# Altium project Sirius_Black.PrjPcb (part 2 of 2)

## Sheet Sensor Suite 1.SchDoc
size A4; SheetNumber: 4; SheetTotal: 6
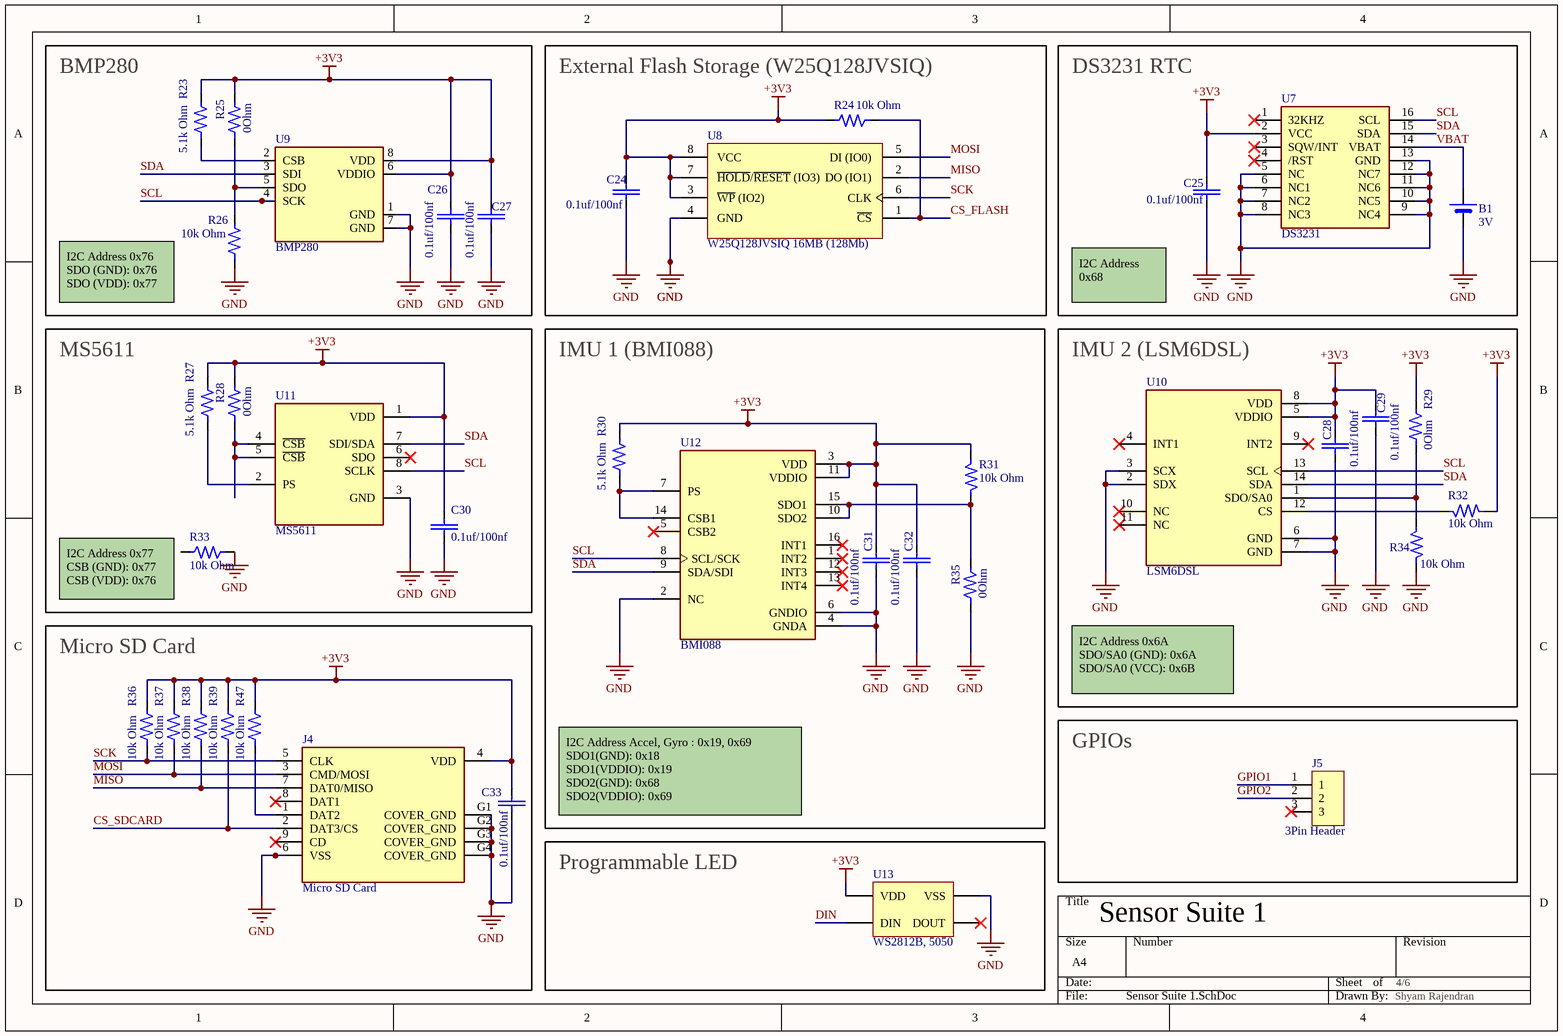
[diagram p3: Sensor Suite 1.SchDoc]

### Parts
B1  3V  [Battery Holder]
C24  0.1uf/100nf  [0.1uF Capacitor]
C25  0.1uf/100nf  [0.1uF Capacitor]
C26  0.1uf/100nf  [0.1uF Capacitor]
C27  0.1uf/100nf  [0.1uF Capacitor]
C28  0.1uf/100nf  [0.1uF Capacitor]
C29  0.1uf/100nf  [0.1uF Capacitor]
C30  0.1uf/100nf  [0.1uF Capacitor]
C31  0.1uf/100nf  [0.1uF Capacitor]
C32  0.1uf/100nf  [0.1uF Capacitor]
C33  0.1uf/100nf  [0.1uF Capacitor]
J4  Micro SD Card  [Micro SD Card]
J5  3Pin Header  [3 Pin Header]
R23  5.1k Ohm  [RESC2012X60N]
R24  10k Ohm  [RESC2013X60X35ML10T20]
R25  0Ohm  [1k 0805 Resistor]
R26  10k Ohm  [RESC2013X60X35ML10T20]
R27  5.1k Ohm  [RESC2012X60N]
R28  0Ohm  [1k 0805 Resistor]
R29  0Ohm  [1k 0805 Resistor]
R30  5.1k Ohm  [RESC2012X60N]
R31  10k Ohm  [RESC2013X60X35ML10T20]
R32  10k Ohm  [RESC2013X60X35ML10T20]
R33  10k Ohm  [RESC2013X60X35ML10T20]
R34  10k Ohm  [RESC2013X60X35ML10T20]
R35  0Ohm  [1k 0805 Resistor]
R36  10k Ohm  [RESC2013X60X35ML10T20]
R37  10k Ohm  [RESC2013X60X35ML10T20]
R38  10k Ohm  [RESC2013X60X35ML10T20]
R39  10k Ohm  [RESC2013X60X35ML10T20]
R47  10k Ohm  [RESC2013X60X35ML10T20]
U7  DS3231 RTC  [DS3231]  (value not drawn)
U8  W25Q128JVSIQ 16MB (128Mb)  [W25Q128JVSIQ]
U9  BMP280  [BMP280]
U10  LSM6DSL  [LSM6DSO32TR]
U11  MS5611  [MS561101BA03-50]
U12  BMI088  [BMI088]
U13  WS2812B, 5050  [WS2812B]

### Blocks framed on the sheet
BMP280: C26 C27 R23 R25 R26 U9
External Flash Storage (W25Q128JVSIQ): C24 R24 U8
DS3231 RTC: B1 C25 U7
MS5611: C30 R27 R28 R33 U11
IMU 1 (BMI088): C31 C32 R30 R31 R35 U12
IMU 2 (LSM6DSL): C28 C29 R29 R32 R34 U10
Micro SD Card: C33 J4 R36-R39 R47
GPIOs: J5
Programmable LED: U13

### Nets
+3V3: C24.1 C25.1 C26.2 C27.2 C28.2 C29.2 C30.2 C31.2 C32.2 C33.2 J4.4(VDD) R23.2 R24.2 R25.2 R27.2 R28.2 R29.2 R30.2 R31.2 R32.1 R36.2 R37.2 R38.2 R39.2 R47.2 U7.2(VCC) U8.3(~{WP}_(IO2)) U8.7(~{HOLD}/~{RESET}_(IO3)) U8.8(VCC) U9.6(VDDIO) U9.8(VDD) U10.5(VDDIO) U10.8(VDD) U11.1(VDD) U12.3(VDD) U12.11(VDDIO) U13.VDD
GND: B1.N C24.2 C25.2 C26.1 C27.1 C28.1 C29.1 C30.1 C31.1 C32.1 C33.1 J4.6(VSS) J4.G1(COVER_GND) J4.G2(COVER_GND) J4.G3(COVER_GND) J4.G4(COVER_GND) R26.1 R33.1 R34.1 R35.1 U7.5(NC) U7.6(NC1) U7.7(NC2) U7.8(NC3) U7.9(NC4) U7.10(NC5) U7.11(NC6) U7.12(NC7) U7.13(GND) U8.4(GND) U9.1(GND) U9.7(GND) U10.2(SDX) U10.3(SCX) U10.6(GND) U10.7(GND) U11.3(GND) U12.2(NC) U12.4(GNDA) U12.6(GNDIO) U13.VSS
CS_FLASH: R24.1 U8.1(~{CS})
CS_SDCARD: J4.2(DAT3/CS) R39.1
DIN: U13.DIN
GPIO1: J5.1
GPIO2: J5.2
MISO: J4.7(DAT0/MISO) R38.1 U8.2(DO_(IO1))
MOSI: J4.3(CMD/MOSI) R37.1 U8.5(DI_(IO0))
SCK: J4.5(CLK) R36.1 U8.6(CLK)
SCL: U7.16(SCL) U9.4(SCK) U10.13(SCL) U11.8(SCLK) U12.8(SCL/SCK)
SDA: U7.15(SDA) U9.3(SDI) U10.14(SDA) U11.7(SDI/SDA) U12.9(SDA/SDI)
VBAT: B1.P U7.14(VBAT)
NetJ4_1: J4.1(DAT2) R47.1
NetR23_1: R23.1 U9.2(CSB)
NetR25_1: R25.1 R26.2 U9.5(SDO)
NetR27_1: R27.1 U11.2(PS)
NetR28_1: R28.1 U11.4(~{CSB}) U11.5(~{CSB})
NetR29_1: R29.1 R34.2 U10.1(SDO/SA0)
NetR30_1: R30.1 U12.7(PS) U12.14(CSB1)
NetR31_1: R31.1 R35.2 U12.10(SDO2) U12.15(SDO1)
NetR32_2: R32.2 U10.12(CS)

Not connected (* = marked no-connect by the designer): J4 8(DAT1)* 9(CD)*; J5 3*; R33 2; U7 1(32KHZ)* 3(SQW/INT)* 4(/RST)*; U10 4(INT1)* 9(INT2)* 10(NC)* 11(NC)*; U11 6(SDO)*; U12 1(INT2)* 5(CSB2)* 12(INT3)* 13(INT4)* 16(INT1)*; U13 DOUT*

### Notes on the sheet
- I2C Address 0x76
  SDO (GND): 0x76
  SDO (VDD): 0x77
- I2C Address 0x68
- (near R33) I2C Address 0x77
  CSB (GND): 0x77
  CSB (VDD): 0x76
- I2C Address 0x6A
  SDO/SA0 (GND): 0x6A
  SDO/SA0 (VCC): 0x6B
- (near C33) I2C Address Accel, Gyro : 0x19, 0x69
  SDO1(GND): 0x18
  SDO1(VDDIO): 0x19
  SDO2(GND): 0x68
  SDO2(VDDIO): 0x69
- Sensor Suite 1 <BMP280>
- 4/6 <BMP280>
- Shyam Rajendran <BMP280>

### Library data of the parts
B1 = Button Cell: CR2032 Button Cell
C24-C33 = CC0805KRX7R9BB104: 0.1 uF, Multilayer Ceramic Capacitor, 50 V, ï¿½ 10%, X7R, 0805 [2012 Metric]; Manufacturer: Yageo; Value: 100nF; Voltage Rating: 50V; Insulation Resistance: 100GR; Supplier: Future Electronics; Supplier Part Number: 2986263; Manufacturer Part Number: CC0805KRX7R9BB104; RoHS: Yes; Category: Ceramic Capacitors; Stock: 2884000; Pricing: 4000=0.009, 12000=0.0088, 40000=0.0085, 80000=0.0083, 160000=0.008 (USD); Mounting Technology: Surface Mount; Case/Package: 0805; Pins: 2; Case Code (Metric): 2012; Case Code (Imperial): 0805; Material: Ceramic; Min Operating Temperature: -55°C; Max Operating Temperature: 125°C; Packaging: Tape and Reel; Tolerance: 10%; Dielectric: X7R; Series: CC; Package Quantity: 4000; Voltage: 50V; Termination: SMD/SMT; Length: 2mm; Height: 0.85mm; Depth: 1.25mm; Radiation Hardening: No; RoHS Compliant: Yes; Lead Free: 5697LeadFree; Reach SVHC Compliant: No; Halogen Free: 5694HalogenFree
J4 = Micro SD Card: Micro SD Card Connector, 9 Positions, Connector and Ejector, Push In, Auto Eject Out, Surface Mount, 1.8 mm Height Above Board, Gold Flash; MF: CUI Devices; MP: MSD-1-A; SnapEDA_Link: https://www.snapeda.com/parts/MSD-1-A/CUI+Devices/view-part/?ref=snap; Package: None; Value: *; CUI_purchase_URL: https://www.cuidevices.com/product/interconnect/connectors/memory-card-connectors/sd-card-connectors/msd-1-a?utm_source=snapeda.com&utm_medium=referral&utm_campaign=snapedaBOM; Check_prices: https://www.snapeda.com/parts/MSD-1-A/CUI+Devices/view-part/?ref=eda
J5 = Header 3pin
R23 R27 R30 = RC0805FR-075K1L: 5.1k Ohm, 0805, 0.125W, 150V, 1% +/-Tol, 100ppm/Cel, Surface Mount; Manufacturer: Yageo; Additional Feature: LASER TRIMMABLE; Power: 125mW; Rated Temperature: 70°C; Value: 5.1kR; Temperature Coefficient (ppm/Cel): 100; Package Height: 0.5mm; Package Length: 2mm; Package Width: 1.25mm; Supplier: Future Electronics; Supplier Part Number: 5647425; Manufacturer Part Number: RC0805FR-075K1L; RoHS: Yes; Category: Chip SMD Resistors; Stock: 15000; Pricing: 5000=0.0021, 20000=0.002, 100000=0.0019, 200000=0.0018, 625000=0.0017 (USD); Mounting Technology: Surface Mount; Pins: 2; Package Shape: Rectangular; Case/Package: 0805; Terminal Finish: Nickel; Min Operating Temperature: -55°C; Max Operating Temperature: 155°C; Tolerance: 1%; JESD-609 Code: e3; Termination: Wraparound; Resistor Type: FIXED RESISTOR; Construction: Chip; Packaging: Tape and Reel; Technology: METAL GLAZE/THICK FILM; Working Voltage: 150V; Reach SVHC Compliant: Yes; RoHS Compliant: Yes; ComponentLink1URL: https://datasheet.ciiva.com:443/pdfs/VipMasterIC/IC/YAGO/YAGO-S-A0008145938/YAGO-S-A0008145938-1.pdf?src-supplier=IHS+Markit; ComponentLink1Description: https://datasheet.ciiva.com:443/pdfs/VipMasterIC/IC/YAGO/YAGO-S-A0008145938/YAGO-S-A0008145938-1.pdf?src-supplier=IHS+Markit; ComponentLink2URL: https://datasheet.ciiva.com/11808/0900766b8106beab-11808171.pdf?src-supplier=Rs; ComponentLink2Description: https://datasheet.ciiva.com/11808/0900766b8106beab-11808171.pdf?src-supplier=Rs; ComponentLink3URL: https://datasheet.ciiva.com/2456/pyu-r-int-thick-7-2456979.pdf?src-supplier=Digikey; ComponentLink3Description: https://datasheet.ciiva.com/2456/pyu-r-int-thick-7-2456979.pdf?src-supplier=Digikey; ComponentLink4URL: https://datasheet.ciiva.com/2456/pyu-r-int-thick-7-2456980.pdf?src-supplier=Digikey; ComponentLink4Description: https://datasheet.ciiva.com/2456/pyu-r-int-thick-7-2456980.pdf?src-supplier=Digikey; ComponentLink5URL: https://datasheet.ciiva.com/15189/getdatasheetpartid-326574-15189996.pdf?src-supplier=Verical; ComponentLink5Description: https://datasheet.ciiva.com/15189/getdatasheetpartid-326574-15189996.pdf?src-supplier=Verical; ComponentLink6URL: https://datasheet.ciiva.com/2456/pyu-r-int-thick-7-2456978.pdf?src-supplier=Digikey; ComponentLink6Description: https://datasheet.ciiva.com/2456/pyu-r-int-thick-7-2456978.pdf?src-supplier=Digikey
R24 R26 R31-R34 R36-R39 R47 = RC0805FR-0710KL: 10 kOhm, SMD Chip Resistor, ï¿½ 1%, 125 mW, 0805 [2012 Metric], Thick Film, General Purpose; Manufacturer: Yageo; Value: 10kR; Power Rating: 125mW; Voltage Rating: 150V; Temperature Coefficient: 100ppm/°C; Supplier: Future Electronics; Supplier Part Number: 3310877; Manufacturer Part Number: RC0805FR-0710KL; RoHS: Yes; Category: Chip SMD Resistors; Stock: 15945000; Pricing: 5000=0.0021, 20000=0.002, 100000=0.0019, 200000=0.0018, 625000=0.0017 (USD); Case/Package: 0805; Case Code (Imperial): 0805; Case Code (Metric): 2012; Min Operating Temperature: -55°C; Max Operating Temperature: 155°C; Packaging: Tape and Reel; Tolerance: 1%; Termination: SMD/SMT; Number of Terminations: 2; Max Power Dissipation: 125mW; Features: Moisture Resistant; Series: RC; Resistor Type: Thick Film; Construction: Rectangular; Resistance Tolerance: 1%; Package Quantity: 1; Technology: THICK FILM; Voltage Rating (AC): 150V; Length: 0.079inch; Width: 0.049inch; Height: 0.024inch; Depth: 1.25mm; Lead Free: Lead Free; RoHS Compliant: Yes; Military Standard: Not; Reach SVHC Compliant: Unknown; ComponentLink1URL: https://datasheet.ciiva.com/11808/0900766b8106beab-11808151.pdf?src-supplier=Rs; ComponentLink1Description: https://datasheet.ciiva.com/11808/0900766b8106beab-11808151.pdf?src-supplier=Rs; ComponentLink2URL: https://datasheet.ciiva.com/46447/444164-46447563.pdf?src-supplier=Element14; ComponentLink2Description: https://datasheet.ciiva.com/46447/444164-46447563.pdf?src-supplier=Element14; ComponentLink3URL: https://datasheet.ciiva.com/2456/pyu-r-int-thick-7-2456973.pdf?src-supplier=Digikey; ComponentLink3Description: https://datasheet.ciiva.com/2456/pyu-r-int-thick-7-2456973.pdf?src-supplier=Digikey; ComponentLink4URL: https://datasheet.ciiva.com/2456/pyu-r-int-thick-7-2456974.pdf?src-supplier=Digikey; ComponentLink4Description: https://datasheet.ciiva.com/2456/pyu-r-int-thick-7-2456974.pdf?src-supplier=Digikey; ComponentLink5URL: https://datasheet.ciiva.com/2456/pyu-r-int-thick-7-2456972.pdf?src-supplier=Digikey; ComponentLink5Description: https://datasheet.ciiva.com/2456/pyu-r-int-thick-7-2456972.pdf?src-supplier=Digikey; ComponentLink6URL: https://datasheet.ciiva.com/12669/rc0805-12669688.pdf?src-supplier=Mouser; ComponentLink6Description: https://datasheet.ciiva.com/12669/rc0805-12669688.pdf?src-supplier=Mouser; ComponentLink7URL: https://datasheet.ciiva.com/16747/rc0805-16747087.pdf?src-supplier=Future+Electronics; ComponentLink7Description: https://datasheet.ciiva.com/16747/rc0805-16747087.pdf?src-supplier=Future+Electronics
R25 R28 R29 R35 = CRCW08050000Z0EA: 0 Ohm Resistor, Jumper, 0805 [2012 Metric], Thick Film, 125 mW, Surface Mount; Manufacturer: Vishay; Value: 0mR; Power Rating: 125mW; Temperature Coefficient: 100ppm/°C; Voltage Rating: 150V; Tolerance: 1%; Supplier: Arrow Electronics; Supplier Part Number: CRCW08050000Z0EA; Manufacturer Part Number: CRCW08050000Z0EA; RoHS: Yes; Category: Chip SMD Resistors; Stock: 1390000; Pricing: 5000=0.0051, 10000=0.005, 15000=0.0049, 25000=0.0045 (USD); Case/Package: 0805; Case Code (Imperial): 0805; Case Code (Metric): 2012; Contact Plating: Tin; Weight: 0.000194oz; Min Operating Temperature: -55°C; Max Operating Temperature: 155°C; Packaging: Tape and Reel; Series: CRCW; Number of Terminations: 2; Resistor Type: Thick Film; Termination: SMD/SMT; Max Power Dissipation: 125mW; Package Quantity: 1; Features: Automotive AEC-Q200; Construction: Rectangular; Technology: THICK FILM; Voltage Rating (DC): 150V; Resistance Tolerance: 1%; Length: 2mm; Width: 0.049inch; Height: 0.45mm; Depth: 1.25mm; Radiation Hardening: No; RoHS Compliant: Yes; Military Standard: Not; Reach SVHC Compliant: Unknown; Lead Free: 5697LeadFree; ComponentLink1URL: https://datasheet.ciiva.com/11811/0900766b80d98b26-11811304.pdf?src-supplier=Rs; ComponentLink1Description: https://datasheet.ciiva.com/11811/0900766b80d98b26-11811304.pdf?src-supplier=Rs; ComponentLink2URL: https://datasheet.ciiva.com/7841/1720486-7841839.pdf?src-supplier=Element14; ComponentLink2Description: https://datasheet.ciiva.com/7841/1720486-7841839.pdf?src-supplier=Element14; ComponentLink3URL: https://datasheet.ciiva.com/26314/fld-crcw-e3-data-en-26314630.pdf?src-supplier=Distrelec; ComponentLink3Description: https://datasheet.ciiva.com/26314/fld-crcw-e3-data-en-26314630.pdf?src-supplier=Distrelec; ComponentLink4URL: https://datasheet.ciiva.com/7841/1697337-7841629.pdf?src-supplier=Element14; ComponentLink4Description: https://datasheet.ciiva.com/7841/1697337-7841629.pdf?src-supplier=Element14; ComponentLink5URL: https://datasheet.ciiva.com/2463/dcrcwe3-2463038.pdf?src-supplier=Digikey; ComponentLink5Description: https://datasheet.ciiva.com/2463/dcrcwe3-2463038.pdf?src-supplier=Digikey; ComponentLink6URL: https://datasheet.ciiva.com/2463/dcrcwe3-2463039.pdf?src-supplier=Digikey; ComponentLink6Description: https://datasheet.ciiva.com/2463/dcrcwe3-2463039.pdf?src-supplier=Digikey; ComponentLink7URL: https://datasheet.ciiva.com/2463/dcrcwe3-2463037.pdf?src-supplier=Digikey; ComponentLink7Description: https://datasheet.ciiva.com/2463/dcrcwe3-2463037.pdf?src-supplier=Digikey; ComponentLink8URL: https://datasheet.ciiva.com/16719/70201119-16719706.pdf?src-supplier=Allied+Electronics; ComponentLink8Description: https://datasheet.ciiva.com/16719/70201119-16719706.pdf?src-supplier=Allied+Electronics; ComponentLink9URL: https://datasheet.ciiva.com/5543/dcrcwe3-109170-5543096.pdf?src-supplier=Mouser; ComponentLink9Description: https://datasheet.ciiva.com/5543/dcrcwe3-109170-5543096.pdf?src-supplier=Mouser; ComponentLink10URL: https://datasheet.ciiva.com/16389/dcrcwe3-16389338.pdf?src-supplier=Future+Electronics; ComponentLink10Description: https://datasheet.ciiva.com/16389/dcrcwe3-16389338.pdf?src-supplier=Future+Electronics
U7 = DS3231: Real Time Clock (RTC) IC Clock/Calendar - IÂ²C, 2-Wire Serial 8-SOIC (0.154, 3.90mm Width); MF: Maxim Integrated; Check_prices: https://www.snapeda.com/parts/DS3231/Maxim+Integrated/view-part/?ref=eda; Value: *; Availability: In Stock; MP: DS3231; Price: None; Package: SOIC-16 Maxim Integrated; SnapEDA_Link: https://www.snapeda.com/parts/DS3231/Maxim+Integrated/view-part/?ref=snap; Purchase-URL: https://pricing.snapeda.com/search/part/DS3231/?ref=eda
U8 = W25Q128JVSIQ TR: 16MB (128Mb) Flash, PDSO8; Manufacturer: Winbond; Package Body Material: Plastic; Clock Frequency: 133MHz; Density: 134217728b; Memory Width: 8; Channels: 1; Memory Size: 16777216; Number of Words Code: 16M; Operating Mode: SYNCHRONOUS; Organization: 16MX8; Parallel/Serial: SERIAL; Programming Voltage: 3V; Max Supply Voltage: 3.6V; Min Supply Voltage: 2.7V; Supplier: Digikey; Supplier Part Number: W25Q128JVSIQCT-ND; Manufacturer Part Number: W25Q128JVSIQ TR; RoHS: Yes; Category: Flash; Stock: 210919; Pricing: 1=1.57, 10=1.472, 25=1.4304, 50=1.3988, 100=1.3668, 250=1.32448, 500=1.2926, 1000=1.26092, 2000=1.22957, 4000=1.19866, 6000=1.18081 (USD); Case/Package: SOP; Pins: 8; Package Shape: Square; Min Operating Temperature: -40°C; Max Operating Temperature: 85°C; Memory Format: FLASH; Type: NOR TYPE; JESD-30 Code: S-PDSO-G8; Package Style: SMALL OUTLINEMeter; Nominal Supply Voltage: 3V; Surface Mount: Yes; Technology: CMOS; Terminal Form: Gull Wing; Terminal Position: DUAL; Length: 5.23mm; Width: 5.23mm; Height - Seated (Max): 2.16mm; Terminal Pitch: 1.27mm; Temperature Grade: INDUSTRIAL; Reach SVHC Compliant: Yes; RoHS Compliant: Yes; ComponentLink1URL: https://datasheet.ciiva.com:443/pdfs/VipMasterIC/IC/WBND/WBND-S-A0002933800/WBND-S-A0002933800-1.pdf?src-supplier=IHS+Markit; ComponentLink1Description: https://datasheet.ciiva.com:443/pdfs/VipMasterIC/IC/WBND/WBND-S-A0002933800/WBND-S-A0002933800-1.pdf?src-supplier=IHS+Markit; ComponentLink2URL: http://www.winbond.com/resource-files/w25q128jv%20revf%2003272018%20plus.pdf?src-supplier=Digikey; ComponentLink2Description: http://www.winbond.com/resource-files/w25q128jv%20revf%2003272018%20plus.pdf?src-supplier=Digikey; ComponentLink3URL: http://www.winbond.com/resource-files/w25q128jv%20spi%20revc%2011162016.pdf?src-supplier=Digikey; ComponentLink3Description: http://www.winbond.com/resource-files/w25q128jv%20spi%20revc%2011162016.pdf?src-supplier=Digikey
U9 = BMP280: BMP280 Absolute Barometric Pressure Sensor for Battery Powered Devices 2 x 2.5mm; Package: None; Availability: Unavailable; MP: BMP280; Value: *; Price: None
U10 = LSM6DSL: Accelerometer, Gyroscope, Temperature, 6 Axis Sensor IÂ²C, SPI Output; MF: STMicroelectronics; SnapEDA_Link: https://www.snapeda.com/parts/LSM6DSO32TR/STMicroelectronics/view-part/?ref=snap; Package: VFLGA-14 STMicroelectronics; Value: *; MP: LSM6DSO32TR; Check_prices: https://www.snapeda.com/parts/LSM6DSO32TR/STMicroelectronics/view-part/?ref=eda
U11 = MS561101BA03-50: Sensor;MS5611-BT M-CAPS 3X5X1MM T&R;Pressure;MS561101BA03-50 | TE Connectivity MS561101BA03-50; SnapEDA_Link: https://www.snapeda.com/parts/MS561101BA03-50/TE+Connectivity+ALCOSWITCH+Switches/view-part/?ref=snap; Package: SMD-8 Measurement Specialties; Value: *; MF: TE Connectivity; MP: MS561101BA03-50; Check_prices: https://www.snapeda.com/parts/MS561101BA03-50/TE+Connectivity+ALCOSWITCH+Switches/view-part/?ref=eda
U12 = BMI088: High-performance 6-axis inertial sensor (accelerometer + gyroscope) <a href="https://pricing.snapeda.com/parts/BMI088/Bosch%20Sensortec/view-part?ref=eda">Check prices</a>; Package: None; MP: BMI088; Value: *; Availability: Unavailable; Price: None
U13 = WS2812B: Intelligent Control LED Integrated Light Source, 3.5 to 5.3 V, -25 to 80 degC, 4-Pin SMD, RoHS, Tape and Reel; Manufacturer: Adafruit-Industries-LLC; Number of LEDs: 10; Configuration: Discrete; Utilized LED: WS2812(5050); Datasheet URL: http://datasheet.octopart.com/ADA1655-Adafruit-Industries-datasheet-32028139.pdf; Series: Neopixel; Interface: -; Package Description: 4-Pin Surface Mount Device, Body 5 x 5 mm; Color: Red,Green,Blue(RGB); Category: Optoelectronics; Controller Type: -; Package Reference: 1655; Manufacturer URL: https://www.adafruit.com/; Mounting Type: SurfaceMount; Datasheet Version: May-13; Size / Dimension: 5.00mmLx5.00mmW; Family: Addressable,Specialty

## Sheet Sensor Suite 2.SchDoc
size A4; SheetNumber: 5; SheetTotal: 6
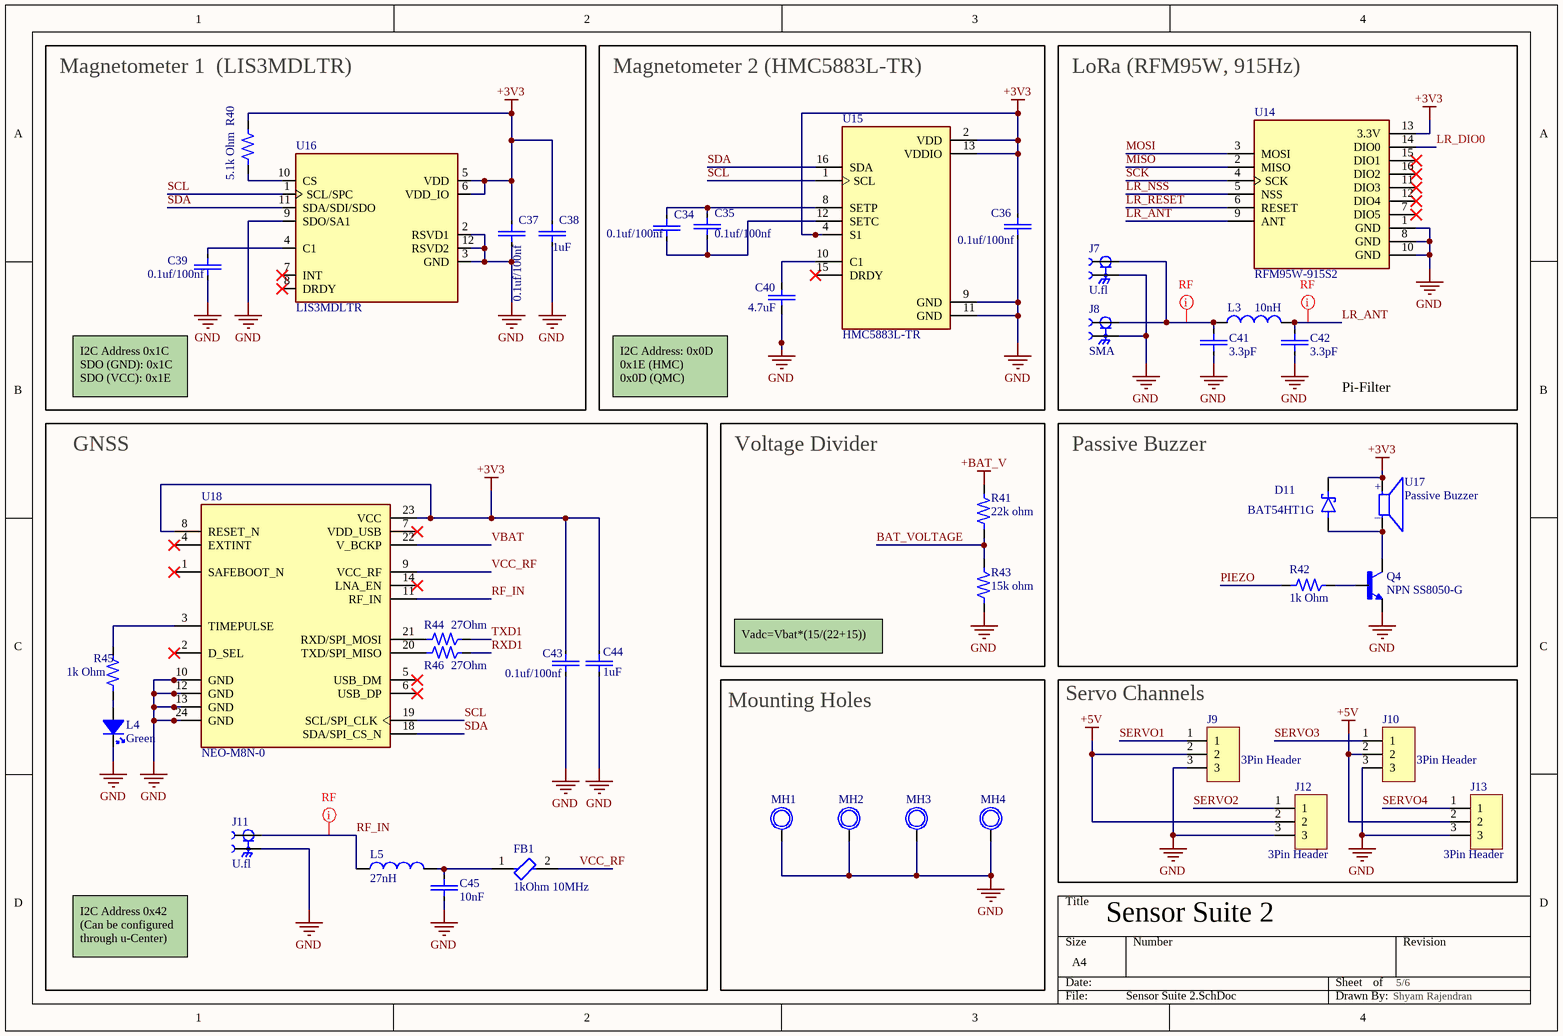
[diagram p4: Sensor Suite 2.SchDoc]

### Parts
C34  0.1uf/100nf  [0.1uF Capacitor]
C35  0.1uf/100nf  [0.1uF Capacitor]
C36  0.1uf/100nf  [0.1uF Capacitor]
C37  0.1uf/100nf  [0.1uF Capacitor]
C38  1uF  [10uf Capacitor]
C39  0.1uf/100nf  [0.1uF Capacitor]
C40  4.7uF  [1k 0805 Resistor]
C41  3.3pF  [3.3pF]
C42  3.3pF  [3.3pF]
C43  0.1uf/100nf  [0.1uF Capacitor]
C44  1uF  [10uf Capacitor]
C45  10nF  [3.3pF]
D11  BAT54HT1G  [SOD2513X110N]
FB1  1kOhm 10MHz  [1kOhm Ferrite bead 0402]
J7  U.fl  [U.fl]
J8  SMA  [SMA_CONNECTOR]
J9  3Pin Header  [3 Pin Header]
J10  3Pin Header  [3 Pin Header]
J11  U.fl  [U.fl]
J12  3Pin Header  [3 Pin Header]
J13  3Pin Header  [3 Pin Header]
L3  10nH  [0402 10nH]
L4  Green  [LED Green]
L5  27nH  [0402 10nH]
MH1  PMH 3.0  [PMH]  (value not drawn)
MH2  PMH 3.0  [PMH]  (value not drawn)
MH3  PMH 3.0  [PMH]  (value not drawn)
MH4  PMH 3.0  [PMH]  (value not drawn)
Q4  NPN SS8050-G  [Transistor_SS8050-G]
R40  5.1k Ohm  [RESC2012X60N]
R41  22k ohm  [1k 0805 Resistor]
R42  1k Ohm  [1k 0805 Resistor]
R43  15k ohm  [1k 0805 Resistor]
R44  27Ohm  [1k 0805 Resistor]
R45  1k Ohm  [1k 0805 Resistor]
R46  27Ohm  [1k 0805 Resistor]
U14  RFM95W-915S2  [RFM95W-915S2]
U15  HMC5883L-TR  [HMC5883L-TR]
U16  LIS3MDLTR  [LIS3MDLTR]
U17  Passive Buzzer  [BuzzerCMT-7525-80-SMT-TR]
U18  NEO-M8N-0  [NEO-M8N-0]

### Blocks framed on the sheet
Magnetometer 1  (LIS3MDLTR): C37-C39 R40 U16
Magnetometer 2 (HMC5883L-TR): C34-C36 C40 U15
LoRa (RFM95W, 915Hz): C41 C42 J7 J8 L3 U14
GNSS: C43-C45 FB1 J11 L4 L5 R44-R46 U18
Voltage Divider: R41 R43
Passive Buzzer: D11 Q4 R42 U17
Mounting Holes: MH1-MH4
Servo Channels: J9 J10 J12 J13

### Nets
+3V3: C36.2 C37.2 C38.2 C43.2 C44.2 D11.C(K) R40.2 U14.13(3.3V) U15.2(VDD) U15.4(S1) U15.13(VDDIO) U16.5(VDD) U16.6(VDD_IO) U17.P U18.8(RESET_N) U18.23(VCC)
+5V: J9.2 J10.2 J12.2 J13.2
+BAT_V: R41.2
GND: C36.1 C37.1 C38.1 C39.1 C40.1 C41.1 C42.1 C43.1 C44.1 C45.1 J7.GND J8.GND J9.3 J10.3 J11.GND J12.3 J13.3 L4.C MH1.GND MH2.GND MH3.GND MH4.GND Q4.2(E) R43.1 U14.1(GND) U14.8(GND) U14.10(GND) U15.9(GND) U15.11(GND) U16.2(RSVD1) U16.3(GND) U16.9(SDO/SA1) U16.12(RSVD2) U18.10(GND) U18.12(GND) U18.13(GND) U18.24(GND)
BAT_VOLTAGE: R41.1 R43.2
LR_ANT: C42.2 L3.2 U14.9(ANT)
LR_DIO0: U14.14(DIO0)
LR_NSS: U14.5(NSS)
LR_RESET: U14.6(RESET)
MISO: U14.2(MISO)
MOSI: U14.3(MOSI)
PIEZO: R42.1
RF_IN: J11.1 L5.1 U18.11(RF_IN)
RXD1: R46.2
SCK: U14.4(SCK)
SCL: U15.1(SCL) U16.1(SCL/SPC) U18.19(SCL/SPI_CLK)
SDA: U15.16(SDA) U16.11(SDA/SDI/SDO) U18.18(SDA/SPI_CS_N)
SERVO1: J9.1
SERVO2: J12.1
SERVO3: J10.1
SERVO4: J13.1
TXD1: R44.2
VBAT: U18.22(V_BCKP)
VCC_RF: FB1.2 U18.9(VCC_RF)
NetC34_1: C34.1 C35.1 U15.12(SETC)
NetC34_2: C34.2 C35.2 U15.8(SETP)
NetC39_2: C39.2 U16.4(C1)
NetC40_2: C40.2 U15.10(C1)
NetC41_2: C41.2 J7.1 J8.1 L3.1
NetC45_2: C45.2 FB1.1 L5.2
NetD11_A: D11.A Q4.3(C) U17.N
NetL4_A: L4.A R45.1
NetQ4_1: Q4.1(B) R42.2
NetR40_1: R40.1 U16.10(CS)
NetR44_1: R44.1 U18.21(RXD/SPI_MOSI)
NetR45_2: R45.2 U18.3(TIMEPULSE)
NetR46_1: R46.1 U18.20(TXD/SPI_MISO)

Not connected (* = marked no-connect by the designer): U14 7(DIO5)* 11(DIO3)* 12(DIO4)* 15(DIO1)* 16(DIO2)*; U15 15(DRDY)*; U16 7(INT)* 8(DRDY)*; U18 1(SAFEBOOT_N)* 2(D_SEL)* 4(EXTINT)* 5(USB_DM)* 6(USB_DP)* 7(VDD_USB)* 14(LNA_EN)*

### Layout directives
net class RF: LR_ANT, NetC41_2, RF_IN

### Notes on the sheet
- I2C Address 0x1C
  SDO (GND): 0x1C
  SDO (VCC): 0x1E
- I2C Address: 0x0D
  0x1E (HMC)
  0x0D (QMC)
- Pi-Filter <BMP280>
- Vadc=Vbat*(15/(22+15))
- Sensor Suite 2 <BMP280>
- I2C Address 0x42
  (Can be configured through u-Center)
- 5/6 <BMP280>
- Shyam Rajendran <BMP280>
- (in symbol Buzzer CMT-7525-80-SMT-TR) +; _

### Library data of the parts
C34-C37 C39 C43 = CC0805KRX7R9BB104: as C24 on sheet Sensor Suite 1; Supplier: Future Electronics; Supplier Part Number: 2986263; Manufacturer Part Number: CC0805KRX7R9BB104; RoHS: Yes; Category: Ceramic Capacitors; Stock: 2884000; Pricing: 4000=0.009, 12000=0.0088, 40000=0.0085, 80000=0.0083, 160000=0.008 (USD); Mounting Technology: Surface Mount; Case/Package: 0805; Pins: 2; Case Code (Metric): 2012; Case Code (Imperial): 0805; Material: Ceramic; Min Operating Temperature: -55°C; Max Operating Temperature: 125°C; Packaging: Tape and Reel; Tolerance: 10%; Dielectric: X7R; Series: CC; Package Quantity: 4000; Voltage: 50V; Termination: SMD/SMT; Length: 2mm; Height: 0.85mm; Depth: 1.25mm; Radiation Hardening: No; RoHS Compliant: Yes; Lead Free: 5697LeadFree; Reach SVHC Compliant: No; Halogen Free: 5694HalogenFree
C38 C44 = CC0805KKX7R6BB105: 1uF, Ceramic Capacitor, Multilayer, Ceramic, 10V, 10% +Tol, 10% -Tol, X7R, 15% TC,Surface Mount, 0805; Manufacturer: Yageo; Multilayer: Yes; Supplier: Future Electronics; Supplier Part Number: 2015429; Manufacturer Part Number: CC0805KKX7R6BB105; RoHS: Yes; Category: Ceramic Capacitors; Stock: 114000; Pricing: 3000=0.0123, 9000=0.012, 30000=0.0117, 60000=0.0116, 120000=0.0112 (USD); Mounting Technology: Surface Mount; Pins: 2; Dielectric Material: Ceramic; Package Shape: Rectangular; Case/Package: 0805; Terminal Finish: Nickel; Min Operating Temperature: -55°C; Max Operating Temperature: 125°C; JESD-609 Code: e3; Value: 1uF; Capacitor Type: Ceramic; Tolerance  (fill in as +-): 10%; Packaging: Tape and Reel; Tolerance (fill in as +-): 10%; Rated DC Voltage (URdc): 10V; Temperature Characteristics Code: X7R; Termination: Wraparound; Package Style: SMTMeter; Length: 2mm; Width: 1.25mm; Height: 1.25mm; Reach SVHC Compliant: Yes; RoHS Compliant: Yes; ComponentLink1URL: https://datasheet.ciiva.com:443/pdfs/VipMasterIC/IC/YAGO/YAGO-S-A0003557223/YAGO-S-A0003557223-1.pdf?src-supplier=IHS+Markit; ComponentLink1Description: https://datasheet.ciiva.com:443/pdfs/VipMasterIC/IC/YAGO/YAGO-S-A0003557223/YAGO-S-A0003557223-1.pdf?src-supplier=IHS+Markit
C40 = 4.7uF Capacitor: 0603, 25V
C41 C42 = 3.3pF Capacitor: 0402
C45 = 10nf Capacitor: TCC0402X7R103J500AT-CCTC-SMT ceramic capacitors 0402 X7R 103J(10nF)±5.0% Rated voltage:50V thickness:0.50mm tape
D11 = BAT54HT1G: BAT54HT1G-ONSEMI-BAT54HT1G-Small Signal Schottky Diode, Single, 30 V, 200 mA, 800 mV, 600 mA, 150 °C; MF: Infineon Technologies; MP: BAS3010A03WE6327HTSA1; Price: None; Mouser-Purchase-URL: https://snapeda.com/shop?store=Mouser&id=447647; Value: *; Arrow_Electronics-Purchase-URL: https://snapeda.com/shop?store=Arrow+Electronics&id=447647; Package: SOD-323 Infineon; DigiKey-Purchase-URL: https://snapeda.com/shop?store=DigiKey&id=447647; SnapEDA_Link: https://www.snapeda.com/parts/BAS3010A03WE6327HTSA1/Infineon%20Technologies/view-part/447647/?ref=snap; Availability: Unavailable
FB1 = BLM21AG102SN1D: Ferrite Beads Multi-Layer 1KOhm 25% 100MHz 600mA 270mOhm DCR 0805 T/R; Manufacturer: Murata; Material: Steel,Ferrite; Impedance: 1kR; Max Current Rating: 500mA; Max DC Current: 200mA; DC Resistance (DCR): 280mR; Number of Lines: 1; Shielding: Unshielded; ESR: 270mR; Supplier: Mouser; Supplier Part Number: 81-BLM21AG102SN1; Manufacturer Part Number: BLM21AG102SN1D; RoHS: Yes; Category: Ferrite Beads and Chips; Stock: 100884; Pricing: 1=0.16, 10=0.083, 50=0.083, 100=0.064, 1000=0.055, 10000=0.038 (USD); Case/Package: 0805; Pins: 2; Core Material: Ferrite; Case Code (Metric): 2012; Case Code (Imperial): 0805; Weight: 0.000194oz; Min Operating Temperature: -55°C; Max Operating Temperature: 125°C; Tolerance: 25%; Package Quantity: 1; Packaging: Tape and Reel; Current Rating: 500mA; Termination: SMD/SMT; Test Frequency: 100MHz; DC Current: 200mA; Frequency: 100MHz; Number of Circuits: 1; Series: BLM21A; DC Resistance-Max: 280mR; RMS Current (Irms): 600mA; Length: 2mm; Width: 1.25mm; Height: 0.85mm; Depth: 1.25mm; Radiation Hardening: No; Reach SVHC Compliant: No; Military Standard: Not; Lead Free: Lead Free; RoHS Compliant: Yes; ComponentLink1URL: https://datasheet.ciiva.com/19454/1845136-19454717.pdf?src-supplier=Jameco; ComponentLink1Description: https://datasheet.ciiva.com/19454/1845136-19454717.pdf?src-supplier=Jameco; ComponentLink2URL: https://datasheet.ciiva.com/41449/001172322-da-01-en-drossel-0805-1000r-2-0x1-25mm-4000st-41449636.pdf?src-supplier=Conrad; ComponentLink2Description: https://datasheet.ciiva.com/41449/001172322-da-01-en-drossel-0805-1000r-2-0x1-25mm-4000st-41449636.pdf?src-supplier=Conrad; ComponentLink3URL: https://datasheet.ciiva.com/29347/442432-da-01-en-chip-drossel-0805-1000r-200ma-2-0x1-25mm-29347996.pdf?src-supplier=Conrad; ComponentLink3Description: https://datasheet.ciiva.com/29347/442432-da-01-en-chip-drossel-0805-1000r-200ma-2-0x1-25mm-29347996.pdf?src-supplier=Conrad; ComponentLink4URL: https://datasheet.ciiva.com/3082/l0110s0100blm21a-3082728.pdf?src-supplier=Avnet; ComponentLink4Description: https://datasheet.ciiva.com/3082/l0110s0100blm21a-3082728.pdf?src-supplier=Avnet; ComponentLink5URL: https://datasheet.ciiva.com/8021/l0110s0100blm21a-8021548.pdf?src-supplier=Element14; ComponentLink5Description: https://datasheet.ciiva.com/8021/l0110s0100blm21a-8021548.pdf?src-supplier=Element14; ComponentLink6URL: https://datasheet.ciiva.com/8021/l0110s0100blm21a-8021550.pdf?src-supplier=Element14; ComponentLink6Description: https://datasheet.ciiva.com/8021/l0110s0100blm21a-8021550.pdf?src-supplier=Element14; ComponentLink7URL: https://datasheet.ciiva.com/6212/l0110s0100blm21a-6212347.pdf?src-supplier=Digikey; ComponentLink7Description: https://datasheet.ciiva.com/6212/l0110s0100blm21a-6212347.pdf?src-supplier=Digikey; ComponentLink8URL: https://datasheet.ciiva.com/6212/l0110s0100blm21a-6212345.pdf?src-supplier=Digikey; ComponentLink8Description: https://datasheet.ciiva.com/6212/l0110s0100blm21a-6212345.pdf?src-supplier=Digikey; ComponentLink9URL: https://datasheet.ciiva.com/6212/l0110s0100blm21a-6212318.pdf?src-supplier=Digikey; ComponentLink9Description: https://datasheet.ciiva.com/6212/l0110s0100blm21a-6212318.pdf?src-supplier=Digikey
J7 J11 = U.fl: ufl connector; MP: CONUFL001-SMD-T; Package: None; Price: None; Value: *; Availability: Unavailable
J8 = SMA_CONNECTOR: Straight SMA Connector; MP: altium_native_batch; Value: *; Package: None; Availability: Unavailable; Price: None
J9 J10 J12 J13 = Header 3pin
L3 = 10nH Inductor: 0402
L4 = LED Green: Green 0805
L5 = 27nH Inductor: 0402
MH1-MH4 = PMH: PMH 3.0mm
Q4 = SS8050-G: Trans Gp Bjt NPN 25V 1.5A 300MW 3-PIN SOT-23 T/r; Manufacturer: Comchip; Transition Frequency: 100MHz; Collector-emitter Voltage-Max: 400mV; Collector Base Voltage (VCBO): 40V; Collector Emitter Saturation Voltage: 500mV; Emitter Base Voltage (VEBO): 5V; hFE Min: 200; Number of Elements: 1; Supplier: Digikey; Supplier Part Number: 641-1790-1-ND; Manufacturer Part Number: SS8050-G; RoHS: Yes; Category: Transistors; Stock: 150601; Pricing: 1=0.24, 10=0.148, 100=0.0921, 500=0.06754, 1000=0.05958 (USD); Mounting Technology: Surface Mount; Case/Package: TO-236-3; Max Operating Temperature: 150°C; Packaging: Cut Tape; Max Collector Current: 1.5A; Max Power Dissipation: 300mW; Collector Emitter Breakdown Voltage: 25V; Max Breakdown Voltage: 25V; Series: -; Power Dissipation: 300mW; Height: 1.15mm; RoHS Compliant: Yes; ComponentLink1URL: http://www.comchiptech.com/admin/files/product/SS8050-G RevA181526.pdf?src-supplier=Digikey; ComponentLink1Description: http://www.comchiptech.com/admin/files/product/SS8050-G RevA181526.pdf?src-supplier=Digikey
R40 = RC0805FR-075K1L: as R23 on sheet Sensor Suite 1; Supplier: Future Electronics; Supplier Part Number: 5647425; Manufacturer Part Number: RC0805FR-075K1L; RoHS: Yes; Category: Chip SMD Resistors; Stock: 15000; Pricing: 5000=0.0021, 20000=0.002, 100000=0.0019, 200000=0.0018, 625000=0.0017 (USD); Mounting Technology: Surface Mount; Pins: 2; Package Shape: Rectangular; Case/Package: 0805; Terminal Finish: Nickel; Min Operating Temperature: -55°C; Max Operating Temperature: 155°C; Tolerance: 1%; JESD-609 Code: e3; Termination: Wraparound; Resistor Type: FIXED RESISTOR; Construction: Chip; Packaging: Tape and Reel; Technology: METAL GLAZE/THICK FILM; Working Voltage: 150V; Reach SVHC Compliant: Yes; RoHS Compliant: Yes; ComponentLink1URL: https://datasheet.ciiva.com:443/pdfs/VipMasterIC/IC/YAGO/YAGO-S-A0008145938/YAGO-S-A0008145938-1.pdf?src-supplier=IHS+Markit; ComponentLink1Description: https://datasheet.ciiva.com:443/pdfs/VipMasterIC/IC/YAGO/YAGO-S-A0008145938/YAGO-S-A0008145938-1.pdf?src-supplier=IHS+Markit; ComponentLink2URL: https://datasheet.ciiva.com/11808/0900766b8106beab-11808171.pdf?src-supplier=Rs; ComponentLink2Description: https://datasheet.ciiva.com/11808/0900766b8106beab-11808171.pdf?src-supplier=Rs; ComponentLink3URL: https://datasheet.ciiva.com/2456/pyu-r-int-thick-7-2456979.pdf?src-supplier=Digikey; ComponentLink3Description: https://datasheet.ciiva.com/2456/pyu-r-int-thick-7-2456979.pdf?src-supplier=Digikey; ComponentLink4URL: https://datasheet.ciiva.com/2456/pyu-r-int-thick-7-2456980.pdf?src-supplier=Digikey; ComponentLink4Description: https://datasheet.ciiva.com/2456/pyu-r-int-thick-7-2456980.pdf?src-supplier=Digikey; ComponentLink5URL: https://datasheet.ciiva.com/15189/getdatasheetpartid-326574-15189996.pdf?src-supplier=Verical; ComponentLink5Description: https://datasheet.ciiva.com/15189/getdatasheetpartid-326574-15189996.pdf?src-supplier=Verical; ComponentLink6URL: https://datasheet.ciiva.com/2456/pyu-r-int-thick-7-2456978.pdf?src-supplier=Digikey; ComponentLink6Description: https://datasheet.ciiva.com/2456/pyu-r-int-thick-7-2456978.pdf?src-supplier=Digikey
R41 = 22k Resistor: 0805
R42 R45 = RC0805FR-071KL: 1k Ohm, 0805, SMD Chip Resistor , ï¿½ 1%, 125 mW,[2012 Metric], Thick Film, General Purpose; Manufacturer: Yageo; Value: 1kR; Power Rating: 125mW; Voltage Rating: 150V; Temperature Coefficient: 100ppm/°C; Supplier: Future Electronics; Supplier Part Number: 8126013; Manufacturer Part Number: RC0805FR-071KL; RoHS: Yes; Category: Chip SMD Resistors; Stock: 5450000; Pricing: 5000=0.0021, 20000=0.002, 100000=0.0019, 200000=0.0018, 625000=0.0017 (USD); Case/Package: 0805; Pins: 2; Case Code (Metric): 2012; Case Code (Imperial): 0805; Min Operating Temperature: -55°C; Max Operating Temperature: 155°C; Tolerance: 1%; Packaging: Tape and Reel; Voltage Rating (DC): 150V; Resistor Type: Thick Film; Series: RC; Number of Terminations: 2; Termination: SMD/SMT; Max Power Dissipation: 125mW; Resistance Tolerance: 1%; Package Quantity: 1; Features: Moisture Resistant; Construction: Rectangular; Voltage Rating (AC): 150V; Length: 0.079inch; Width: 0.049inch; Height: 0.024inch; Depth: 1.25mm; RoHS Compliant: Yes; Reach SVHC Compliant: No; Military Standard: Not; Lead Free: Lead Free
R43 = 15k Resistor: 0805
R44 R46 = RT0805FRE0727RL: 27 Ohm, Res Thin Film 0805 1% 1/8W ±50ppm/°C Molded SMD SMD Paper T/R; Manufacturer: Yageo; Value: 27R; Power Rating: 125mW; Voltage Rating (DC): 150V; Supplier: Future Electronics; Supplier Part Number: 9105398; Manufacturer Part Number: RT0805FRE0727RL; RoHS: Yes; Category: Chip SMD Resistors; Stock: 30000; Pricing: 5000=0.0055, 20000=0.0053, 50000=0.0051, 125000=0.005, 200000=0.0048 (USD); Case/Package: 0805; Pins: 2; Case Code (Metric): 2012; Case Code (Imperial): 0805; Contact Plating: Tin,Matte; Min Operating Temperature: -55°C; Max Operating Temperature: 125°C; Tolerance: 1%; Packaging: Tape and Reel; Package Quantity: 5000; Number of Terminations: 2; Temperature Coefficient: 50ppm/°C; Max Power Dissipation: 125mW; Series: RT; Voltage Rating: 150V; Resistor Type: Thin Film; Termination: SMD/SMT; Resistance Tolerance: 1%; Length: 0.079inch; Width: 0.049inch; Height: 0.024inch; RoHS Compliant: Yes; Reach SVHC Compliant: Unknown; ComponentLink1URL: https://datasheet.ciiva.com/2561/pyu-rt-1-to-0-05-rohs-l-5-2561109.pdf?src-supplier=Digikey; ComponentLink1Description: https://datasheet.ciiva.com/2561/pyu-rt-1-to-0-05-rohs-l-5-2561109.pdf?src-supplier=Digikey; ComponentLink2URL: https://datasheet.ciiva.com/8889/pyu-rt-1-to-0-05-rohs-l-4-8889865.pdf?src-supplier=Avnet; ComponentLink2Description: https://datasheet.ciiva.com/8889/pyu-rt-1-to-0-05-rohs-l-4-8889865.pdf?src-supplier=Avnet; ComponentLink3URL: https://datasheet.ciiva.com/7942/1392914-7942123.pdf?src-supplier=Element14; ComponentLink3Description: https://datasheet.ciiva.com/7942/1392914-7942123.pdf?src-supplier=Element14; ComponentLink4URL: https://datasheet.ciiva.com/7942/1392914-7942124.pdf?src-supplier=Element14; ComponentLink4Description: https://datasheet.ciiva.com/7942/1392914-7942124.pdf?src-supplier=Element14
U14 = RFM95W-915S2: RFM95(W) - Low Power Long Range Transceiver Module V1.0; Availability: Unavailable; MP: RFM95W-915S2; Value: *; Package: None; Price: None
U15 = HMC5883L-TR: Board Mount Hall Effect / Magnetic Sensors Sensors, Transducers Magnetic - Hall Effect, Digital Switch, Linear, Compass (ICs) - IC COMPASS 3 AXIS I2C 16LCC SMD; MF: STMicroelectronics; MP: HMC5883LTR; Price: None; SnapEDA_Link: https://www.snapeda.com/parts/HMC5883LTR/STMicroelectronics/view-part/?ref=snap; Check_prices: https://www.snapeda.com/parts/HMC5883LTR/STMicroelectronics/view-part/?ref=eda; Package: LCC-16 STMicroelectronics; Availability: Not in stock; Value: *
U16 = LIS3MDLTR: Magnetoresistive Sensor X, Y, Z Axis 12-LGA _2x2_; MF: STMicroelectronics; Availability: Unavailable; Price: None; SnapEDA_Link: https://www.snapeda.com/parts/LIS3MDLTR/STMicroelectronics/view-part/382740/?ref=snap; Package: VFLGA-12 STMicroelectronics; Value: *; MP: LIS3MDLTR
U17 = Buzzer CMT-7525-80-SMT-TR: 7.5 mm, 3.6 Vo-p, 80 dB, Surface Mount (SMT), Magnetic Audio Transducer Buzzer; MF: CUI Devices; Value: *; Digi-Key_Part_Number: 102-CMT-7525-80-SMT-TR-ND; SnapEDA_Link: https://www.snapeda.com/parts/CMT-7525-80-SMT-TR/CUI+Devices/view-part/?ref=snap; Check_prices: https://www.snapeda.com/parts/CMT-7525-80-SMT-TR/CUI+Devices/view-part/?ref=eda; CUI_purchase_URL: https://www.cuidevices.com/product/audio/buzzers/audio-transducers/cmt-7525-80-smt-tr?utm_source=snapeda.com&utm_medium=referral&utm_campaign=snapedaBOM; Purchase-URL: https://pricing.snapeda.com/search/part/CMT-7525-80-SMT-TR/?ref=eda; Package: CUI Devices; MP: CMT-7525-80-SMT-TR
U18 = NEO-M8N-0: Ic Receiver Gps/Gnss 24lcc; Package: None; Price: None; Availability: Unavailable; MP: NEO-M8N-0; Value: *

## Sheet Pyro Channel.SchDoc
size A4; SheetNumber: 6; SheetTotal: 6
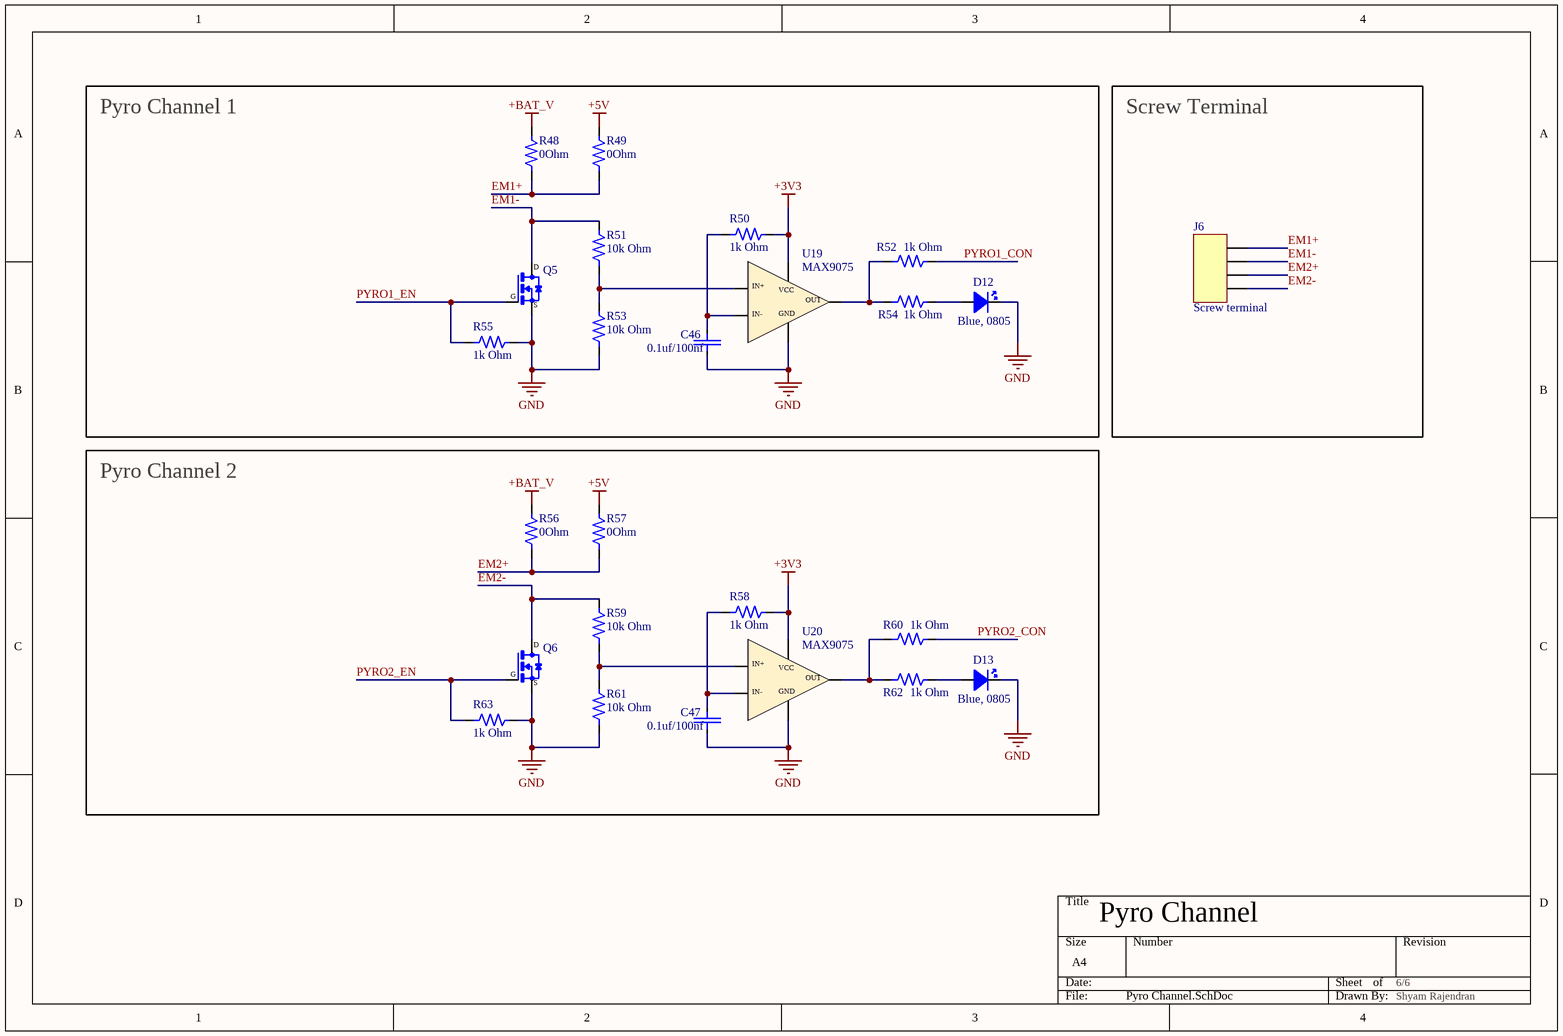
[diagram p5: Pyro Channel.SchDoc]

### Parts
C46  0.1uf/100nf  [0.1uF Capacitor]
C47  0.1uf/100nf  [0.1uF Capacitor]
D12  Blue, 0805  [led blue]
D13  Blue, 0805  [led blue]
J6  Screw terminal  [Screw terminal]
Q5  WNM2021  [P Mosfet SL2P10A]  (value not drawn)
Q6  WNM2021  [P Mosfet SL2P10A]  (value not drawn)
R48  0Ohm  [1k 0805 Resistor]
R49  0Ohm  [1k 0805 Resistor]
R50  1k Ohm  [1k 0805 Resistor]
R51  10k Ohm  [RESC2013X60X35ML10T20]
R52  1k Ohm  [1k 0805 Resistor]
R53  10k Ohm  [RESC2013X60X35ML10T20]
R54  1k Ohm  [1k 0805 Resistor]
R55  1k Ohm  [1k 0805 Resistor]
R56  0Ohm  [1k 0805 Resistor]
R57  0Ohm  [1k 0805 Resistor]
R58  1k Ohm  [1k 0805 Resistor]
R59  10k Ohm  [RESC2013X60X35ML10T20]
R60  1k Ohm  [1k 0805 Resistor]
R61  10k Ohm  [RESC2013X60X35ML10T20]
R62  1k Ohm  [1k 0805 Resistor]
R63  1k Ohm  [1k 0805 Resistor]
U19  MAX9075  [Comparator MAX9075]
U20  MAX9075  [Comparator MAX9075]

### Blocks framed on the sheet
Pyro Channel 1: C46 D12 Q5 R48-R55 U19
Screw Terminal: J6
Pyro Channel 2: C47 D13 Q6 R56-R63 U20

### Nets
+3V3: R50.2 R58.2 U19.VCC U20.VCC
+5V: R49.2 R57.2
+BAT_V: R48.2 R56.2
GND: C46.1 C47.1 D12.C D13.C Q5.S Q6.S R53.1 R55.2 R61.1 R63.2 U19.GND U20.GND
EM1+: J6.1 R48.1 R49.1
EM1-: J6.2 Q5.D R51.2
EM2+: J6.3 R56.1 R57.1
EM2-: J6.4 Q6.D R59.2
PYRO1_CON: R52.2
PYRO1_EN: Q5.G R55.1
PYRO2_CON: R60.2
PYRO2_EN: Q6.G R63.1
NetC46_2: C46.2 R50.1 U19.IN-
NetC47_2: C47.2 R58.1 U20.IN-
NetD12_A: D12.A R54.2
NetD13_A: D13.A R62.2
NetR51_1: R51.1 R53.2 U19.IN+
NetR52_1: R52.1 R54.1 U19.OUT
NetR59_1: R59.1 R61.2 U20.IN+
NetR60_1: R60.1 R62.1 U20.OUT

### Notes on the sheet
- Pyro Channel <BMP280>
- 6/6 <BMP280>
- Shyam Rajendran <BMP280>

### Library data of the parts
C46 C47 = CC0805KRX7R9BB104: as C24 on sheet Sensor Suite 1; Supplier: Future Electronics; Supplier Part Number: 2986263; Manufacturer Part Number: CC0805KRX7R9BB104; RoHS: Yes; Category: Ceramic Capacitors; Stock: 2884000; Pricing: 4000=0.009, 12000=0.0088, 40000=0.0085, 80000=0.0083, 160000=0.008 (USD); Mounting Technology: Surface Mount; Case/Package: 0805; Pins: 2; Case Code (Metric): 2012; Case Code (Imperial): 0805; Material: Ceramic; Min Operating Temperature: -55°C; Max Operating Temperature: 125°C; Packaging: Tape and Reel; Tolerance: 10%; Dielectric: X7R; Series: CC; Package Quantity: 4000; Voltage: 50V; Termination: SMD/SMT; Length: 2mm; Height: 0.85mm; Depth: 1.25mm; Radiation Hardening: No; RoHS Compliant: Yes; Lead Free: 5697LeadFree; Reach SVHC Compliant: No; Halogen Free: 5694HalogenFree
D12 D13 = LED Blue
J6 = screw terminal: 5.08 pitch
Q5 Q6 = N Mosfet: WNM2021-Slkor-20V 2.3A 86mΩ@2.5V,1A 200mW 1.2V 1 N-channel SOT-323 MOSFETs ROHS; MF: Vishay Siliconix; MP: SI2323DS-T1-E3; SnapEDA_Link: https://www.snapeda.com/parts/SI2323DS-T1-E3/Vishay/view-part/?ref=snap; Package: SOT-23-3 Vishay Siliconix; Value: *; Check_prices: https://www.snapeda.com/parts/SI2323DS-T1-E3/Vishay/view-part/?ref=eda
R48 R49 R56 R57 = CRCW08050000Z0EA: as R25 on sheet Sensor Suite 1; Supplier: Arrow Electronics; Supplier Part Number: CRCW08050000Z0EA; Manufacturer Part Number: CRCW08050000Z0EA; RoHS: Yes; Category: Chip SMD Resistors; Stock: 1390000; Pricing: 5000=0.0051, 10000=0.005, 15000=0.0049, 25000=0.0045 (USD); Case/Package: 0805; Case Code (Imperial): 0805; Case Code (Metric): 2012; Contact Plating: Tin; Weight: 0.000194oz; Min Operating Temperature: -55°C; Max Operating Temperature: 155°C; Packaging: Tape and Reel; Series: CRCW; Number of Terminations: 2; Resistor Type: Thick Film; Termination: SMD/SMT; Max Power Dissipation: 125mW; Package Quantity: 1; Features: Automotive AEC-Q200; Construction: Rectangular; Technology: THICK FILM; Voltage Rating (DC): 150V; Resistance Tolerance: 1%; Length: 2mm; Width: 0.049inch; Height: 0.45mm; Depth: 1.25mm; Radiation Hardening: No; RoHS Compliant: Yes; Military Standard: Not; Reach SVHC Compliant: Unknown; Lead Free: 5697LeadFree; ComponentLink1URL: https://datasheet.ciiva.com/11811/0900766b80d98b26-11811304.pdf?src-supplier=Rs; ComponentLink1Description: https://datasheet.ciiva.com/11811/0900766b80d98b26-11811304.pdf?src-supplier=Rs; ComponentLink2URL: https://datasheet.ciiva.com/7841/1720486-7841839.pdf?src-supplier=Element14; ComponentLink2Description: https://datasheet.ciiva.com/7841/1720486-7841839.pdf?src-supplier=Element14; ComponentLink3URL: https://datasheet.ciiva.com/26314/fld-crcw-e3-data-en-26314630.pdf?src-supplier=Distrelec; ComponentLink3Description: https://datasheet.ciiva.com/26314/fld-crcw-e3-data-en-26314630.pdf?src-supplier=Distrelec; ComponentLink4URL: https://datasheet.ciiva.com/7841/1697337-7841629.pdf?src-supplier=Element14; ComponentLink4Description: https://datasheet.ciiva.com/7841/1697337-7841629.pdf?src-supplier=Element14; ComponentLink5URL: https://datasheet.ciiva.com/2463/dcrcwe3-2463038.pdf?src-supplier=Digikey; ComponentLink5Description: https://datasheet.ciiva.com/2463/dcrcwe3-2463038.pdf?src-supplier=Digikey; ComponentLink6URL: https://datasheet.ciiva.com/2463/dcrcwe3-2463039.pdf?src-supplier=Digikey; ComponentLink6Description: https://datasheet.ciiva.com/2463/dcrcwe3-2463039.pdf?src-supplier=Digikey; ComponentLink7URL: https://datasheet.ciiva.com/2463/dcrcwe3-2463037.pdf?src-supplier=Digikey; ComponentLink7Description: https://datasheet.ciiva.com/2463/dcrcwe3-2463037.pdf?src-supplier=Digikey; ComponentLink8URL: https://datasheet.ciiva.com/16719/70201119-16719706.pdf?src-supplier=Allied+Electronics; ComponentLink8Description: https://datasheet.ciiva.com/16719/70201119-16719706.pdf?src-supplier=Allied+Electronics; ComponentLink9URL: https://datasheet.ciiva.com/5543/dcrcwe3-109170-5543096.pdf?src-supplier=Mouser; ComponentLink9Description: https://datasheet.ciiva.com/5543/dcrcwe3-109170-5543096.pdf?src-supplier=Mouser; ComponentLink10URL: https://datasheet.ciiva.com/16389/dcrcwe3-16389338.pdf?src-supplier=Future+Electronics; ComponentLink10Description: https://datasheet.ciiva.com/16389/dcrcwe3-16389338.pdf?src-supplier=Future+Electronics
R50 R52 R54 R55 R58 R60 R62 R63 = RC0805FR-071KL: as R42 on sheet Sensor Suite 2; Supplier: Future Electronics; Supplier Part Number: 8126013; Manufacturer Part Number: RC0805FR-071KL; RoHS: Yes; Category: Chip SMD Resistors; Stock: 5450000; Pricing: 5000=0.0021, 20000=0.002, 100000=0.0019, 200000=0.0018, 625000=0.0017 (USD); Case/Package: 0805; Pins: 2; Case Code (Metric): 2012; Case Code (Imperial): 0805; Min Operating Temperature: -55°C; Max Operating Temperature: 155°C; Tolerance: 1%; Packaging: Tape and Reel; Voltage Rating (DC): 150V; Resistor Type: Thick Film; Series: RC; Number of Terminations: 2; Termination: SMD/SMT; Max Power Dissipation: 125mW; Resistance Tolerance: 1%; Package Quantity: 1; Features: Moisture Resistant; Construction: Rectangular; Voltage Rating (AC): 150V; Length: 0.079inch; Width: 0.049inch; Height: 0.024inch; Depth: 1.25mm; RoHS Compliant: Yes; Reach SVHC Compliant: No; Military Standard: Not; Lead Free: Lead Free
R51 R53 R59 R61 = RC0805FR-0710KL: as R24 on sheet Sensor Suite 1; Supplier: Future Electronics; Supplier Part Number: 3310877; Manufacturer Part Number: RC0805FR-0710KL; RoHS: Yes; Category: Chip SMD Resistors; Stock: 15945000; Pricing: 5000=0.0021, 20000=0.002, 100000=0.0019, 200000=0.0018, 625000=0.0017 (USD); Case/Package: 0805; Case Code (Imperial): 0805; Case Code (Metric): 2012; Min Operating Temperature: -55°C; Max Operating Temperature: 155°C; Packaging: Tape and Reel; Tolerance: 1%; Termination: SMD/SMT; Number of Terminations: 2; Max Power Dissipation: 125mW; Features: Moisture Resistant; Series: RC; Resistor Type: Thick Film; Construction: Rectangular; Resistance Tolerance: 1%; Package Quantity: 1; Technology: THICK FILM; Voltage Rating (AC): 150V; Length: 0.079inch; Width: 0.049inch; Height: 0.024inch; Depth: 1.25mm; Lead Free: Lead Free; RoHS Compliant: Yes; Military Standard: Not; Reach SVHC Compliant: Unknown; ComponentLink1URL: https://datasheet.ciiva.com/11808/0900766b8106beab-11808151.pdf?src-supplier=Rs; ComponentLink1Description: https://datasheet.ciiva.com/11808/0900766b8106beab-11808151.pdf?src-supplier=Rs; ComponentLink2URL: https://datasheet.ciiva.com/46447/444164-46447563.pdf?src-supplier=Element14; ComponentLink2Description: https://datasheet.ciiva.com/46447/444164-46447563.pdf?src-supplier=Element14; ComponentLink3URL: https://datasheet.ciiva.com/2456/pyu-r-int-thick-7-2456973.pdf?src-supplier=Digikey; ComponentLink3Description: https://datasheet.ciiva.com/2456/pyu-r-int-thick-7-2456973.pdf?src-supplier=Digikey; ComponentLink4URL: https://datasheet.ciiva.com/2456/pyu-r-int-thick-7-2456974.pdf?src-supplier=Digikey; ComponentLink4Description: https://datasheet.ciiva.com/2456/pyu-r-int-thick-7-2456974.pdf?src-supplier=Digikey; ComponentLink5URL: https://datasheet.ciiva.com/2456/pyu-r-int-thick-7-2456972.pdf?src-supplier=Digikey; ComponentLink5Description: https://datasheet.ciiva.com/2456/pyu-r-int-thick-7-2456972.pdf?src-supplier=Digikey; ComponentLink6URL: https://datasheet.ciiva.com/12669/rc0805-12669688.pdf?src-supplier=Mouser; ComponentLink6Description: https://datasheet.ciiva.com/12669/rc0805-12669688.pdf?src-supplier=Mouser; ComponentLink7URL: https://datasheet.ciiva.com/16747/rc0805-16747087.pdf?src-supplier=Future+Electronics; ComponentLink7Description: https://datasheet.ciiva.com/16747/rc0805-16747087.pdf?src-supplier=Future+Electronics
U19 U20 = Comparator MAX9075: Comparator MAX9075 SOT23-5

## Nets that join several sheets
+3V3: MCU (6 pins), Power Distribution (8 pins), Sensor Suite 1 (37 pins), Sensor Suite 2 (16 pins), Pyro Channel (R50.2 R58.2 U19.VCC U20.VCC)
+5V: Power Distribution (8 pins), Sensor Suite 2 (J9.2 J10.2 J12.2 J13.2), Pyro Channel (R49.2 R57.2)
+5V_USB: USB (6 pins), Power Distribution (D7.A)
+BAT_V: Power Distribution (D6.A D8.C Q3.S), Sensor Suite 2 (R41.2), Pyro Channel (R48.2 R56.2)
GND: MCU (18 pins), USB (19 pins), Power Distribution (26 pins), Sensor Suite 1 (41 pins), Sensor Suite 2 (37 pins), Pyro Channel (12 pins)
BAT_VOLTAGE: MCU (U1.7), Sensor Suite 2 (R41.1 R43.2)
CS_FLASH: MCU (U1.19), Sensor Suite 1 (R24.1 U8.1)
CS_SDCARD: MCU (U1.8), Sensor Suite 1 (J4.2 R39.1)
DIN: MCU (U1.6), Sensor Suite 1 (U13.DIN)
DTR_FTDI: MCU (Q2.2 R1.1), USB (U2.2)
GPIO1: MCU (U1.39), Sensor Suite 1 (J5.1)
GPIO2: MCU (U1.38), Sensor Suite 1 (J5.2)
LR_DIO0: MCU (U1.12), Sensor Suite 2 (U14.14)
LR_NSS: MCU (U1.18), Sensor Suite 2 (U14.5)
LR_RESET: MCU (U1.17), Sensor Suite 2 (U14.6)
MISO: MCU (U1.21), Sensor Suite 1 (J4.7 R38.1 U8.2), Sensor Suite 2 (U14.2)
MOSI: MCU (U1.20), Sensor Suite 1 (J4.3 R37.1 U8.5), Sensor Suite 2 (U14.3)
PIEZO: MCU (U1.9), Sensor Suite 2 (R42.1)
PYRO1_CON: MCU (U1.34), Pyro Channel (R52.2)
PYRO1_EN: MCU (U1.25), Pyro Channel (Q5.G R55.1)
PYRO2_CON: MCU (U1.35), Pyro Channel (R60.2)
PYRO2_EN: MCU (U1.24), Pyro Channel (Q6.G R63.1)
RTS_FTDI: MCU (Q1.2 R3.1), USB (U2.3)
RXD1: MCU (U1.11), Sensor Suite 2 (R46.2)
RXD_FTDI: MCU (U1.37), USB (U2.5)
SCK: MCU (U1.22), Sensor Suite 1 (J4.5 R36.1 U8.6), Sensor Suite 2 (U14.4)
SCL: MCU (R7.1 U1.5), Sensor Suite 1 (5 pins), Sensor Suite 2 (U15.1 U16.1 U18.19)
SDA: MCU (R6.1 U1.4), Sensor Suite 1 (5 pins), Sensor Suite 2 (U15.16 U16.11 U18.18)
SERVO1: MCU (U1.23), Sensor Suite 2 (J9.1)
SERVO2: MCU (U1.31), Sensor Suite 2 (J12.1)
SERVO3: MCU (U1.32), Sensor Suite 2 (J10.1)
SERVO4: MCU (U1.33), Sensor Suite 2 (J13.1)
TXD1: MCU (U1.10), Sensor Suite 2 (R44.2)
TXD_FTDI: MCU (U1.36), USB (U2.1)
USBD_N: MCU (R4.2), USB (5 pins)
USBD_P: MCU (R5.2), USB (5 pins)
VBAT: Sensor Suite 1 (B1.P U7.14), Sensor Suite 2 (U18.22)